# EAGLE design pannuhuone (EAGLE 7.3.0)
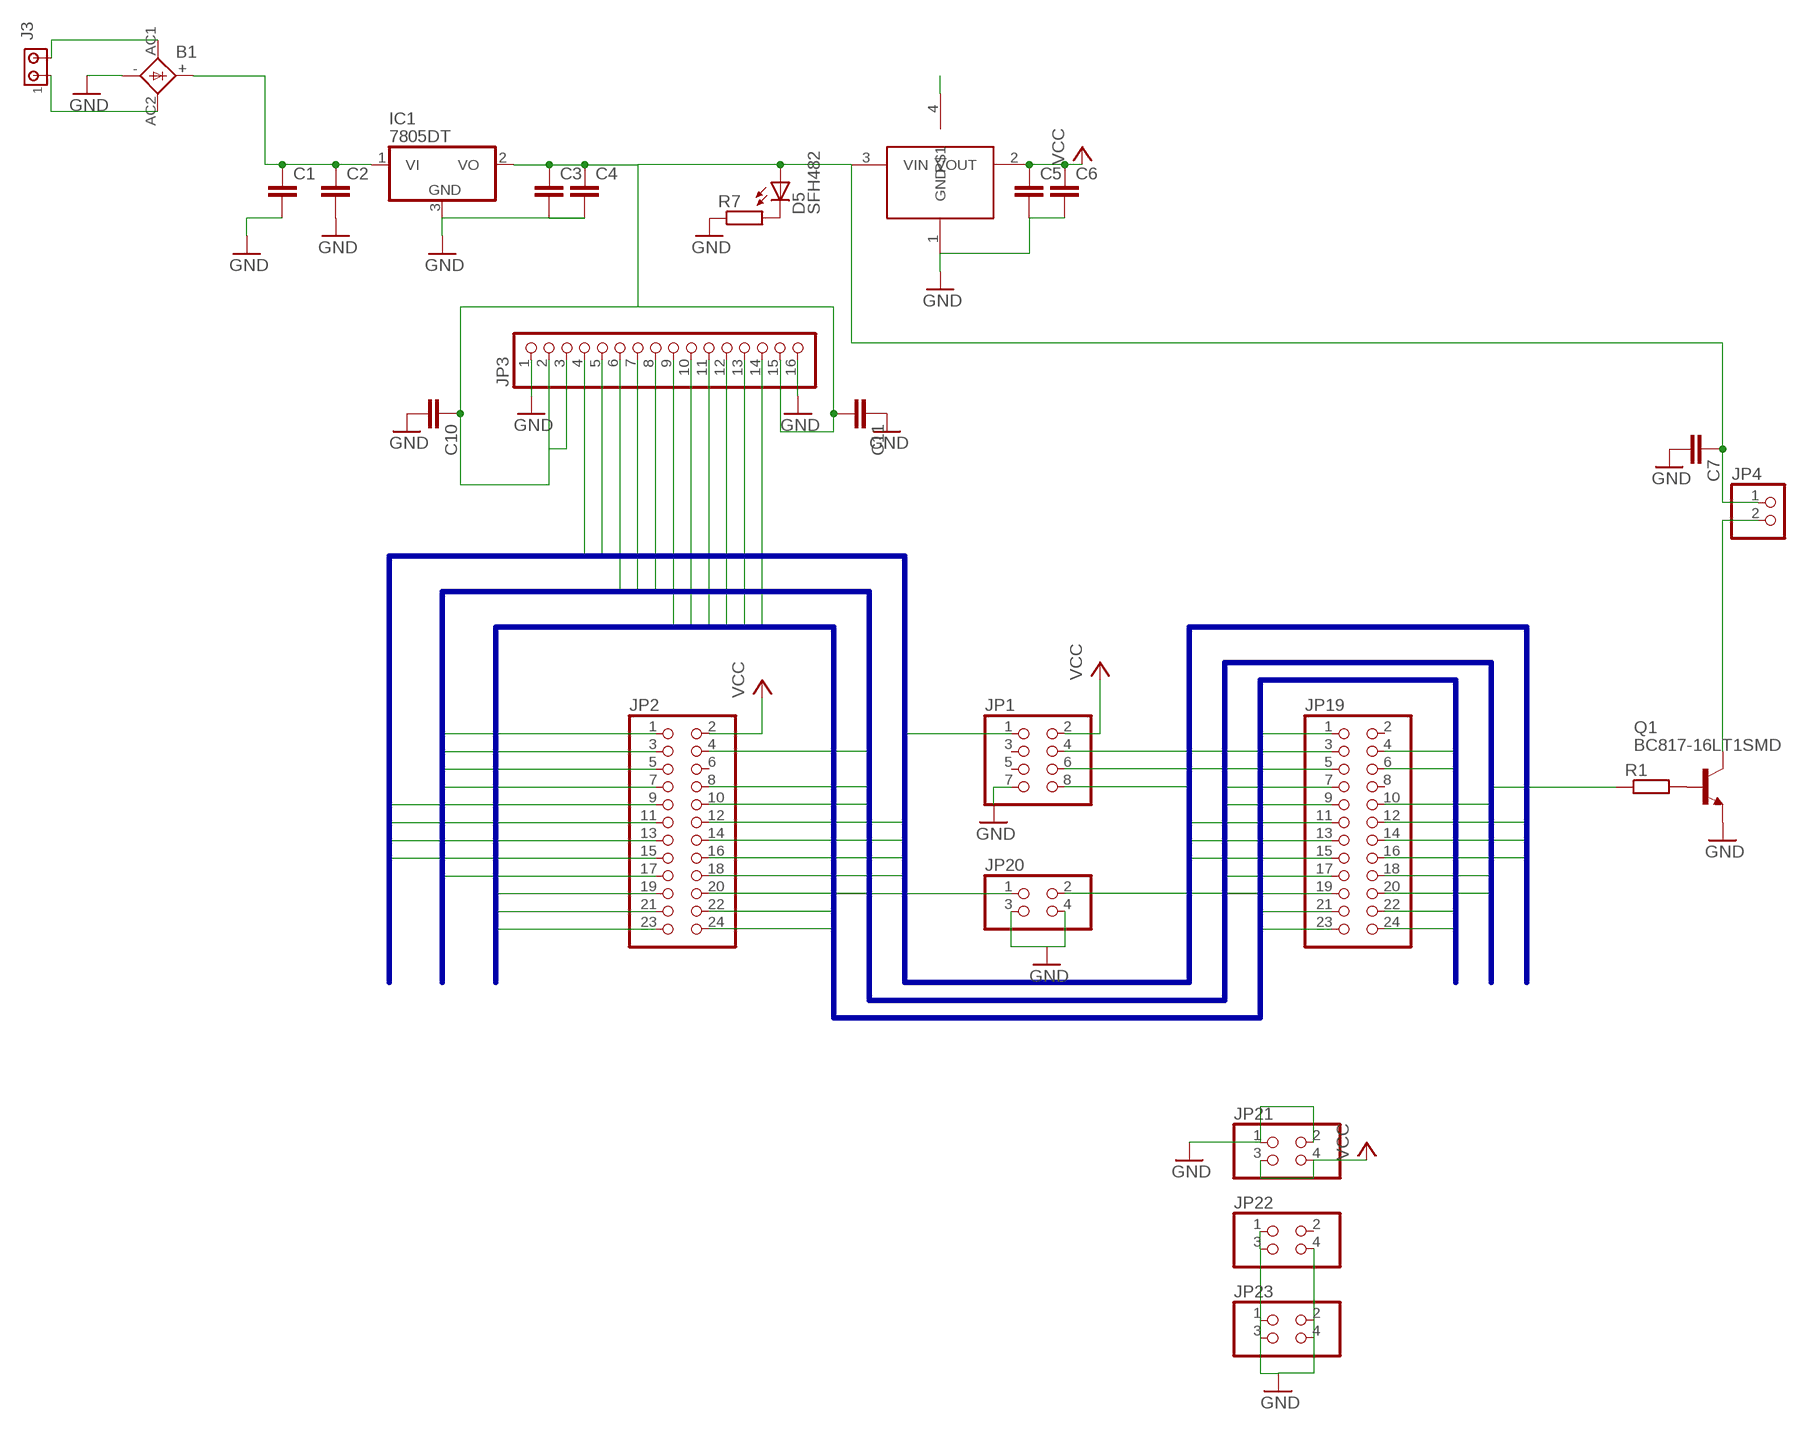
[diagram p0: schematic, sheet 1]

## Parts
B1  2KBB-R  [2KBB-R]
C1  C-EU025-050X050  [C025-050X050]
C2  C-EUC1206  [C1206]
C3  C-EUC1206  [C1206]
C4  C-EUC1206  [C1206]
C5  C-EUC1206  [C1206]
C6  C-EUC1206  [C1206]
C7  C-EUC1206  [C1206]
C10  C-EUC1206  [C1206]
C11  C-EUC1206  [C1206]
D5  SFH482  [SFH482]
IC1  7805DT  [TO252]
J3  MTA02-156  [1X2MTA]
JP1  PINHD-2X4  [2X04]
JP2  PINHD-2X12  [2X12]
JP3  PINHD-1X16  [1X16]
JP4  PINHD-1X2  [1X02]
JP19  PINHD-2X12  [2X12]
JP20  PINHD-2X2  [2X02]
JP21  PINHD-2X2  [2X02]
JP22  PINHD-2X2  [2X02]
JP23  PINHD-2X2  [2X02]
Q1  BC817-16LT1SMD  [SOT23-BEC]
R1  R-EU_R1206  [R1206]
R7  R-EU_R1206  [R1206]
U$2  LD1117  [SOT223]

## Nets
GND: B1.- C1.2 C2.2 C3.2 C4.2 C5.2 C6.2 C7.2 C10.2 C11.1 IC1.3(GND) JP1.7 JP3.1 JP3.16 JP20.3 JP20.4 JP21.1 JP21.2 JP22.1 JP22.3 JP22.4 JP23.1 JP23.2 JP23.3 JP23.4 Q1.E R7.1 U$2.1(GND)
N$1: B1.AC2 J3.1
N$2: C3.1 C4.1 C7.1 C10.1 C11.2 D5.A IC1.2(VO) JP3.2 JP3.3 JP3.15 JP4.1 U$2.3(VIN)
N$6: D5.K(C) R7.2
N$7: B1.AC1 J3.2
N$8: Q1.B R1.2
N$9: JP4.2 Q1.C
N$11: B1.+ C1.1 C2.1 IC1.1(VI)
P$1: U$2.4
SPA0: JP2.9
SPA1: JP2.12
SPA2: JP1.1 JP2.11
SPA3: JP1.8 JP2.14
SPA4: JP2.13
SPA5: JP2.16
SPA6: JP2.15
SPA7: JP2.18
SPA8: JP19.16
SPA9: JP19.15
SPA10: JP19.14
SPA13: JP19.13
SPA14: JP3.4 JP19.11
SPA15: JP3.5 JP19.12
SPB0: JP1.4 JP2.19
SPB1: JP2.22
SPB2: JP2.21
SPB3: JP3.9 JP19.5
SPB4: JP3.10 JP19.6
SPB5: JP19.3
SPB6: JP3.11 JP19.4
SPB7: JP3.12 JP19.1
SPB8: JP3.13 JP20.2
SPB9: JP3.14 JP20.1
SPB10: JP2.24
SPB11: JP1.6 JP2.23
SPB12: JP19.24
SPB13: JP19.23
SPB14: JP19.22
SPB15: JP19.21
SPC0: JP2.5
SPC1: JP2.8
SPC2: JP2.7
SPC3: JP2.10
SPC4: JP2.17
SPC5: JP2.20
SPC6: JP19.20
SPC7: JP19.19 R1.1
SPC8: JP19.18
SPC9: JP19.17
SPC10: JP3.6 JP19.9
SPC11: JP3.7 JP19.10
SPC12: JP3.8 JP19.7
SPC13: JP2.1
SPC14: JP2.4
SPC15: JP2.3
VCC: C5.1 C6.1 JP1.2 JP2.2 JP21.3 JP21.4 U$2.2(VOUT)
Unconnected: JP1.3 JP1.5 JP2.6 JP19.2 JP19.8 JP22.2

## Buses
SPA[0..15]
SPC[0..15]
SPB[0..15]

## Library data of the parts
B1 = rectifier:2KBB-R: RECTIFIER grid 3 x 5 mm
C1-C7 C10 C11 = rcl:C-EU: CAPACITOR, European symbol
D5 = led:SFH482: IR LED infrared emitting diode, Infineon
IC1 = linear:78*: Positive VOLTAGE REGULATOR Source: http://cache.national.com/ds/LM/LM78L05.pdf http://www.fairchildsemi.com/ds/LM/LM7805.pdf
J3 = con-amp:MTA02-156: AMP connector
JP1 = pinhead:PINHD-2X4: PIN HEADER
JP2 JP19 = pinhead:PINHD-2X12: PIN HEADER
JP3 = pinhead:PINHD-1X16: PIN HEADER
JP4 = pinhead:PINHD-1X2: PIN HEADER
JP20-JP23 = pinhead:PINHD-2X2: PIN HEADER
Q1 = transistor-npn:BC817*: NPN Transistor
R1 R7 = rcl:R-EU_: RESISTOR, European symbol
U$2 = tommilib:LD1117

## Board
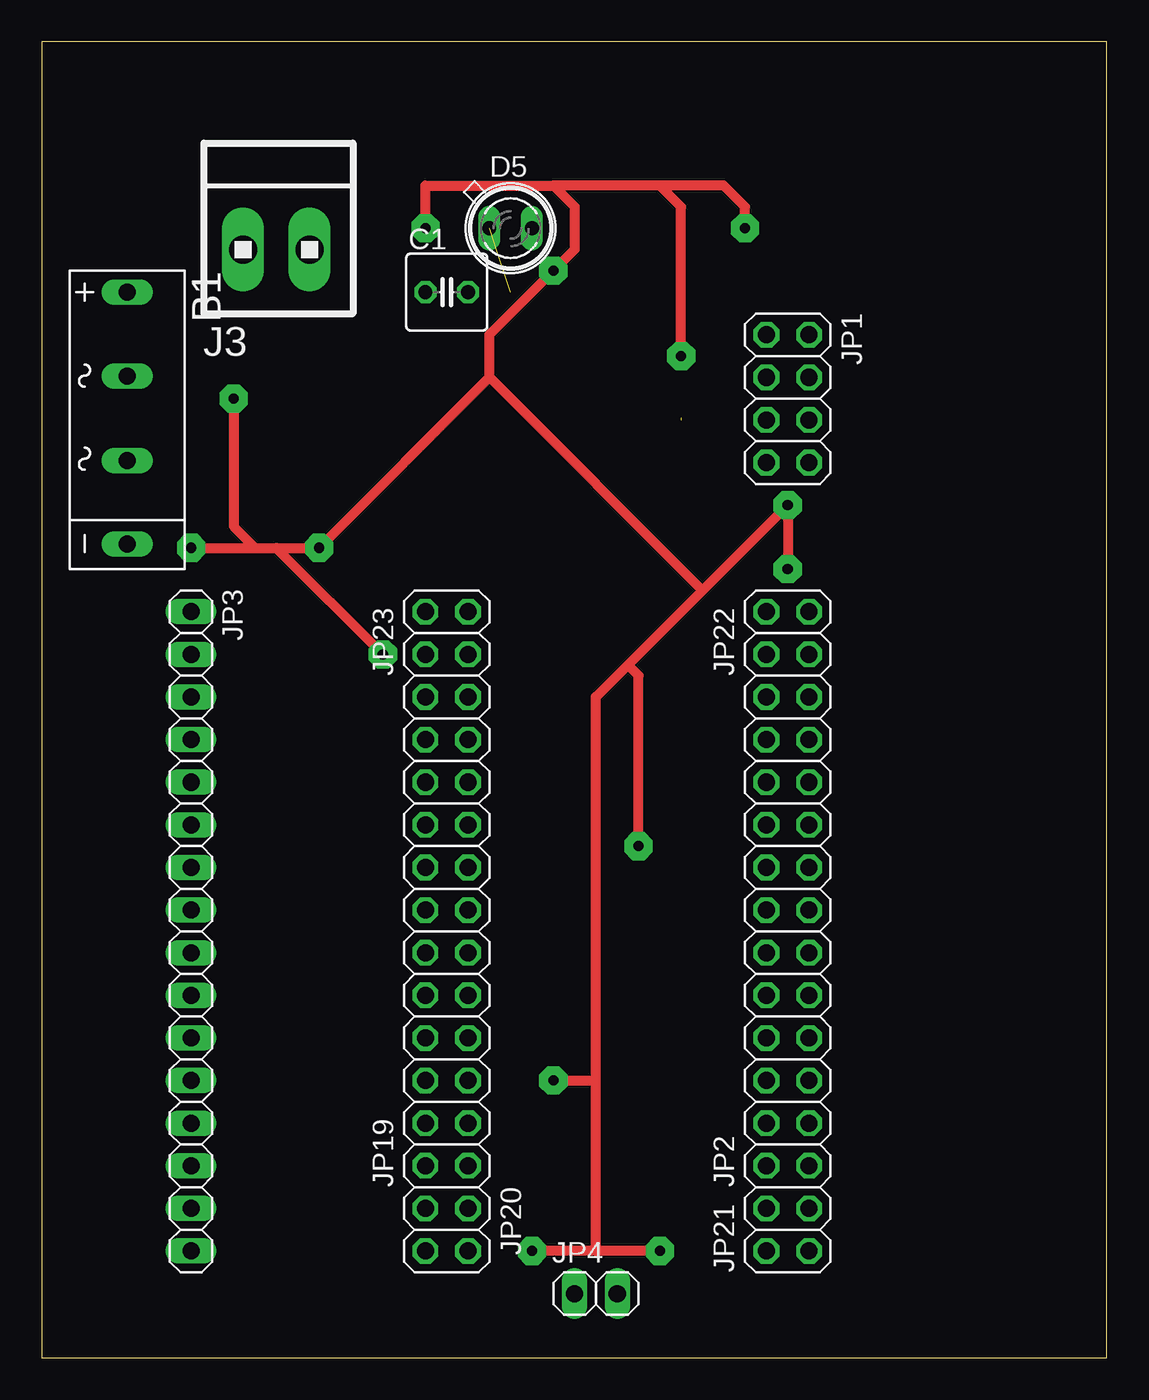
[diagram p1: board, top side]
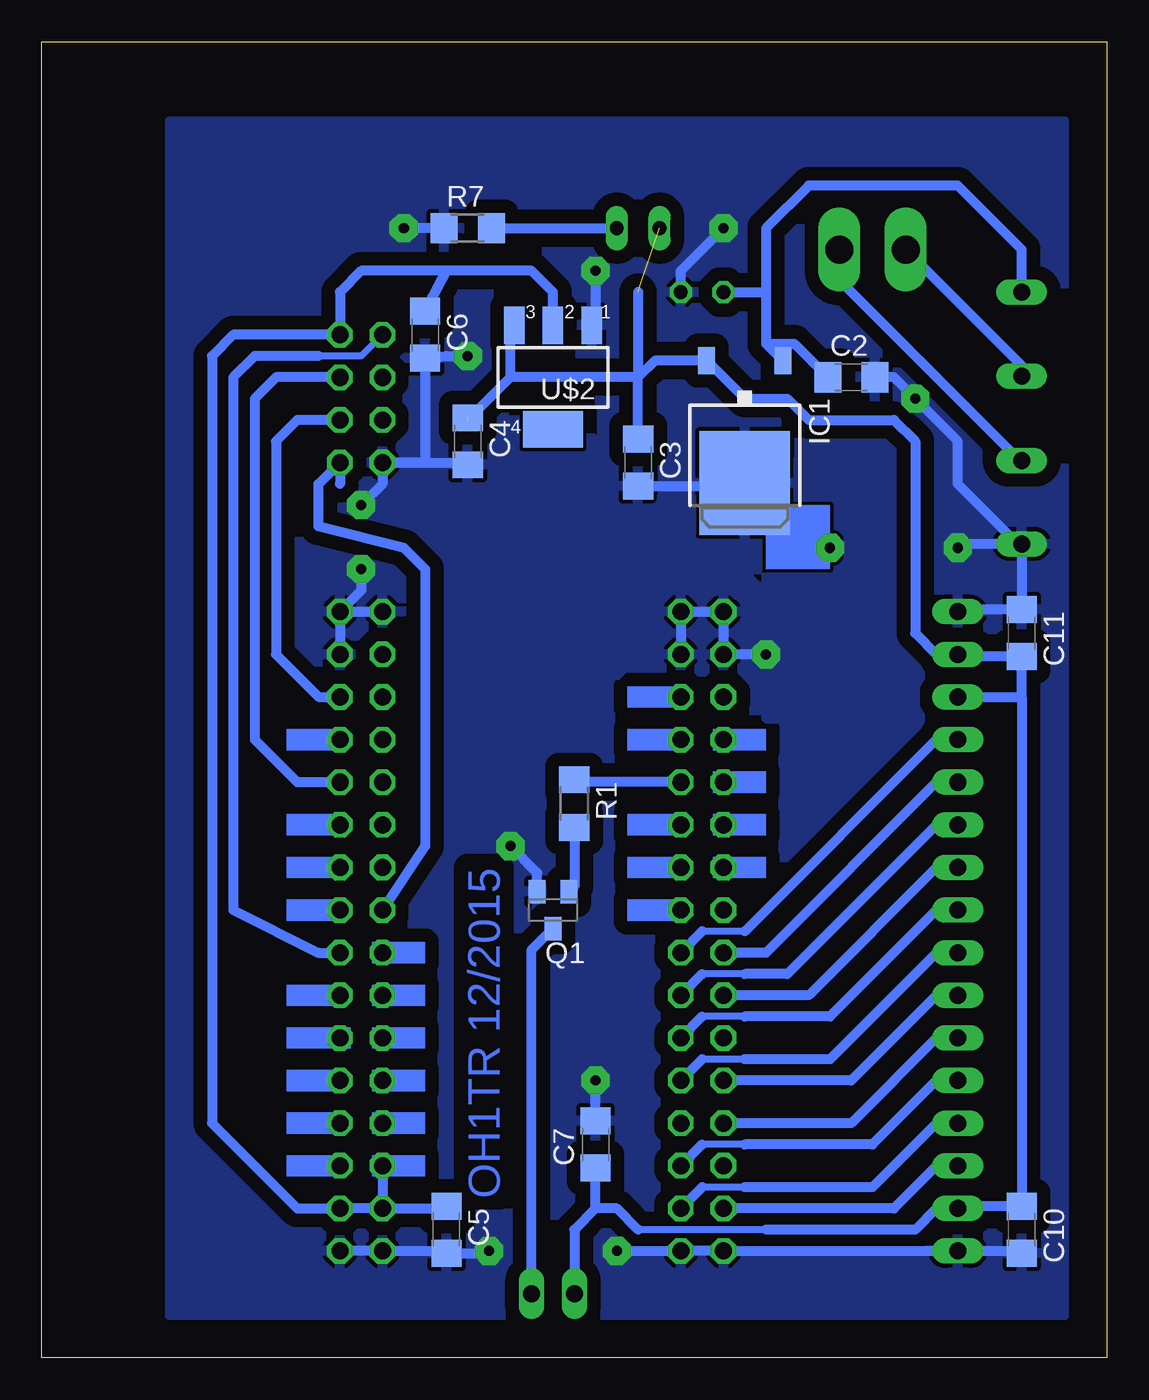
[diagram p2: board, bottom side, seen from below]

Size 63.48 x 78.41 mm. Coordinates in mm from the lower left corner, seen from the top.
Outline: 0,0 63.48,0 63.48,78.41 0,78.41 0,0
Copper layers (1*16): Top 0.035mm / dielectric 1.5mm / Bottom 0.035mm
Design rules "default": minimum track width 10mil, minimum drill 24mil, track to track 8mil, track to pad 8mil, pad to pad 8mil, via to via 8mil, smd to smd 8mil, copper to edge 40mil, drill to drill 8mil, minimum pad ring 10mil, minimum via ring 8mil, stop-mask expansion 4mil, vias tented up to drill 0mil, thermal gap 10mil

### Footprints (pad centres in the part's own frame; a part is rotated, then mirrored left to right if it is on the bottom)
2KBB-R = drill 1.016 long: + -7.62,0; - 7.391,0; AC1 -2.616,0; AC2 2.413,0
C025-050X050 = drill 0.813 octagon: 1 -1.27,0; 2 1.27,0
C1206 = smd 1.6 x 1.8: 1 -1.4,0; 2 1.4,0
SFH482 = drill 0.813 long: A -1.27,0; K 1.27,0
TO252 = smd 1 x 1.6: 1 -2.28,-4.8; 2 2.28,-4.8 | smd 5.4 x 6.2: 3 0,2.5
1X2MTA = drill 1.676 long: 1 1.981,0; 2 -1.981,0
2X04 = drill 1.016 octagon: 1 -3.81,-1.27; 2 -3.81,1.27; 3 -1.27,-1.27; 4 -1.27,1.27; 5 1.27,-1.27; 6 1.27,1.27; 7 3.81,-1.27; 8 3.81,1.27
2X12 = drill 1.016 octagon: 1 -13.97,-1.27; 2 -13.97,1.27; 3 -11.43,-1.27; 4 -11.43,1.27; 5 -8.89,-1.27; 6 -8.89,1.27; 7 -6.35,-1.27; 8 -6.35,1.27; 9 -3.81,-1.27; 10 -3.81,1.27; 11 -1.27,-1.27; 12 -1.27,1.27; 13 1.27,-1.27; 14 1.27,1.27; 15 3.81,-1.27; 16 3.81,1.27; 17 6.35,-1.27; 18 6.35,1.27; 19 8.89,-1.27; 20 8.89,1.27; 21 11.43,-1.27; 22 11.43,1.27; 23 13.97,-1.27; 24 13.97,1.27
1X16 = drill 1.016 long: 1 -19.05,0; 2 -16.51,0; 3 -13.97,0; 4 -11.43,0; 5 -8.89,0; 6 -6.35,0; 7 -3.81,0; 8 -1.27,0; 9 1.27,0; 10 3.81,0; 11 6.35,0; 12 8.89,0; 13 11.43,0; 14 13.97,0; 15 16.51,0; 16 19.05,0
1X02 = drill 1.016 long: 1 -1.27,0; 2 1.27,0
2X02 = drill 1.016 octagon: 1 -1.27,-1.27; 2 -1.27,1.27; 3 1.27,-1.27; 4 1.27,1.27
SOT23-BEC = smd 1 x 1.4: B -0.95,-1.1; C 0,1.1; E 0.95,-1.1
R1206 = smd 1.6 x 1.803: 1 -1.422,0; 2 1.422,0
SOT223 = smd 1.219 x 2.235: 1 -2.311,-3.099; 2 0,-3.099; 3 2.311,-3.099 | smd 3.6 x 2.2: 4 0,3.099

### Placement (x,y rotation side)
B1  5.08,55.88 270 top
C1  24.13,63.5 0 top
C2  15.24,58.42 0 bottom
C3  27.94,53.34 270 bottom
C4  38.1,54.61 270 bottom
C5  39.37,7.62 270 bottom
C6  40.64,60.96 270 bottom
C7  30.48,12.7 90 bottom
C10  5.08,7.62 270 bottom
C11  5.08,43.18 270 bottom
D5  27.94,67.31 0 top
IC1  21.59,54.61 180 bottom
J3  13.97,66.04 0 top
JP1  44.45,57.15 270 top
JP2  44.45,25.4 90 top
JP3  8.89,25.4 270 top
JP4  33.02,3.81 0 top
JP19  24.13,25.4 90 top
JP20  24.13,7.62 270 top
JP21  44.45,7.62 90 top
JP22  44.45,43.18 90 top
JP23  24.13,43.18 90 top
Q1  33.02,26.67 180 bottom
R1  31.75,33.02 270 bottom
R7  38.1,67.31 0 bottom
U$2  33.02,58.42 180 bottom

### Tracks (layer width: path | path; a pad name or v marks a point on that pad's centre or on a via)
GND  (via drill 0.6 pad 1.68)
  Top 0.61: v22.86,67.31 22.86,69.85 30.48,69.85 | 30.48,69.85 31.75,68.58 31.75,66.04 v30.48,64.77 26.67,60.96 26.67,58.42 | v44.45,46.99 v44.45,50.8 39.37,45.72 | v36.83,6.35 33.02,6.35 | 33.02,6.35 v29.21,6.35 | v8.89,48.26 12.7,48.26 | 12.7,48.26 13.97,48.26 | 13.97,48.26 v20.32,41.91 | v41.91,67.31 41.91,68.58 40.64,69.85 36.83,69.85 | 36.83,69.85 30.48,69.85 | v38.1,59.69 38.1,68.58 36.83,69.85 | v11.43,57.15 11.43,49.53 12.7,48.26 | 13.97,48.26 v16.51,48.26 26.67,58.42 | 33.02,6.35 33.02,16.51 | 33.02,16.51 33.02,39.37 34.93,41.28 | 34.93,41.28 39.37,45.72 | 26.67,58.42 39.37,45.72 | v35.56,30.48 35.56,40.64 34.93,41.28 | v30.48,16.51 33.02,16.51
  Bottom 0.61: JP22.3 JP22.4 | JP22.3 JP22.1 | JP21.1 JP21.2 39.5,6.35 C5.2 36.96,6.22 v36.83,6.35 | JP23.1 JP23.3 JP23.4 JP23.2 v20.32,41.91 | JP3.1 8.76,44.58 C11.1 B1.- 5.31,48.49 | C10.2 5.21,6.35 JP3.16 JP20.3 JP20.4 v29.21,6.35 | JP1.7 40.64,53.34 C6.2 39.37,59.69 v38.1,59.69 | JP1.7 38.23,53.34 C4.2 | 5.31,48.49 8.89,52.07 8.89,54.61 v11.43,57.15 12.7,58.42 C2.2 | C1.2 25.4,64.77 v22.86,67.31 | v30.48,64.77 30.48,61.75 U$2.1 | JP1.7 43.18,52.07 v44.45,50.8 | v44.45,46.99 44.45,45.72 JP22.3 | 5.31,48.49 8.66,48.49 v8.89,48.26 | R7.1 v41.91,67.31 | C3.2 21.76,51.94 IC1.3 17.74,48.26 v16.51,48.26 | Q1.E 33.97,28.89 v35.56,30.48 | C7.2 v30.48,16.51
  pour Bottom (isolate 0.813): 2.54,73.66 55.88,73.66 55.88,2.54 2.54,2.54
N$1
  Bottom 0.61: B1.AC2 5.21,53.47 16.51,64.77 16.51,65.48 J3.1
N$2  (2 unrouted)
  Bottom 0.406: 20.32,7.62 27.94,7.62
  Bottom 0.61: 27.94,58.42 26.95,59.41 IC1.2 23.85,59.41 21.59,57.15 19.05,57.15 17.78,55.88 12.7,55.88 11.43,54.61 11.43,43.18 10.16,41.91 JP3.2 8.76,41.78 C11.2 5.08,39.37 | 27.94,58.42 35.56,58.42 | 35.56,58.42 35.56,61.29 U$2.3 | JP3.3 5.08,39.37 | 5.08,39.37 C10.1 8.76,9.02 JP3.15 10.16,8.89 11.43,7.62 20.32,7.62 | C3.1 27.94,58.42 | 38.1,55.88 35.56,58.42 | 27.94,63.5 27.94,58.42 | 27.94,7.62 29.21,8.89 30.48,8.89 | 30.48,8.89 31.75,7.62 JP4.1 | 30.48,8.89 C7.1
N$3
  pour Bottom: 31.75,55.88 30.48,54.61 30.48,50.8 27.94,48.26 27.94,41.91 29.21,40.64 38.1,40.64 38.1,46.99 41.91,50.8 35.56,50.8 35.56,55.88
N$4
  pour Bottom: 24.13,50.8 25.4,50.8 26.67,49.53 26.67,46.99 20.32,46.99 20.32,38.1 11.43,38.1 11.43,40.64 13.97,43.18 13.97,53.34 24.13,53.34
N$5
  pour Bottom: 22.86,44.45 21.59,45.72 21.59,52.07 27.94,52.07
N$6
  Bottom 0.61: R7.2 D5.K
N$7
  Bottom 0.61: 11.43,65.48 J3.2 5.08,59.13 B1.AC1
N$8
  Bottom 0.61: R1.2 31.75,28.09 Q1.B
N$9
  Bottom 0.61: JP4.2 34.29,24.3 Q1.C
N$11
  Bottom 0.61: B1.+ 5.08,66.04 8.89,69.85 17.78,69.85 20.32,67.31 20.32,63.5 | 20.32,63.5 20.32,60.42 | 20.32,60.42 IC1.1 | 20.32,60.42 18.64,60.42 C2.1 | C1.1 20.32,63.5
SPA2
  Bottom 0.406: JP1.1 44.45,59.69 46.99,59.69
  Bottom 0.61: 46.99,59.69 50.8,59.69 52.07,58.42 52.07,26.67 46.99,24.13 JP2.11
SPA3
  Bottom 0.61: 45.72,52.07 JP1.8 46.99,52.07 46.99,49.53 41.91,48.26 40.64,46.99 40.64,30.48 JP2.14
SPA14
  Bottom 0.406: 21.59,25.4 24.13,25.4
  Bottom 0.61: 24.13,25.4 JP19.11 | 21.59,25.4 10.16,36.83 JP3.4
SPA15
  Bottom 0.61: JP19.12 20.32,24.13 10.16,34.29 JP3.5
SPB0
  Bottom 0.61: JP1.4 49.53,58.42 50.8,57.15 50.8,36.83 48.26,34.29 JP2.19
SPB3
  Bottom 0.406: 21.59,17.78 24.13,17.78
  Bottom 0.61: 24.13,17.78 JP19.5 | JP3.9 10.16,24.13 16.51,17.78 21.59,17.78
SPB4
  Bottom 0.61: JP3.10 10.16,21.59 15.24,16.51 JP19.6
SPB6
  Bottom 0.61: JP3.11 10.16,19.05 15.24,13.97 JP19.4
SPB7
  Bottom 0.406: 21.59,12.7 24.13,12.7
  Bottom 0.61: 24.13,12.7 JP19.1 | JP3.12 10.16,16.51 13.97,12.7 21.59,12.7
SPB8
  Bottom 0.406: 21.59,10.16 24.13,10.16
  Bottom 0.61: 24.13,10.16 JP20.2 | JP3.13 10.16,13.97 13.97,10.16 21.59,10.16
SPB9
  Bottom 0.61: JP20.1 12.7,8.89 10.16,11.43 JP3.14
SPB11
  Bottom 0.61: JP1.6 48.26,55.88 49.53,54.61 49.53,41.91 46.99,39.37 JP2.23
SPC7
  Bottom 0.61: JP19.19 31.6,34.29 R1.1
SPC10
  Bottom 0.406: 21.59,22.86 24.13,22.86
  Bottom 0.61: 24.13,22.86 JP19.9 | JP3.6 10.16,31.75 19.05,22.86 21.59,22.86
SPC11
  Bottom 0.61: JP19.10 17.78,21.59 10.16,29.21 JP3.7
SPC12
  Bottom 0.406: 21.59,20.32 24.13,20.32
  Bottom 0.61: 24.13,20.32 JP19.7 | JP3.8 10.16,26.67 16.51,20.32 21.59,20.32
VCC
  Bottom 0.61: JP2.2 JP21.4 | JP21.4 JP21.3 48.26,8.89 53.34,13.97 53.34,59.69 52.07,60.96 JP1.2 45.72,63.5 44.45,64.77 39.37,64.77 | U$2.2 33.02,63.5 34.29,64.77 39.37,64.77 | C6.1 39.37,64.77 | JP21.4 39.5,8.89 C5.1
(copper drawn outside any net)
  shapes: Bottom area x25

### Text on the board
Bottom: OH1TR 12/2015